# Altium schematic sheet Sheet1.SchDoc
size A3
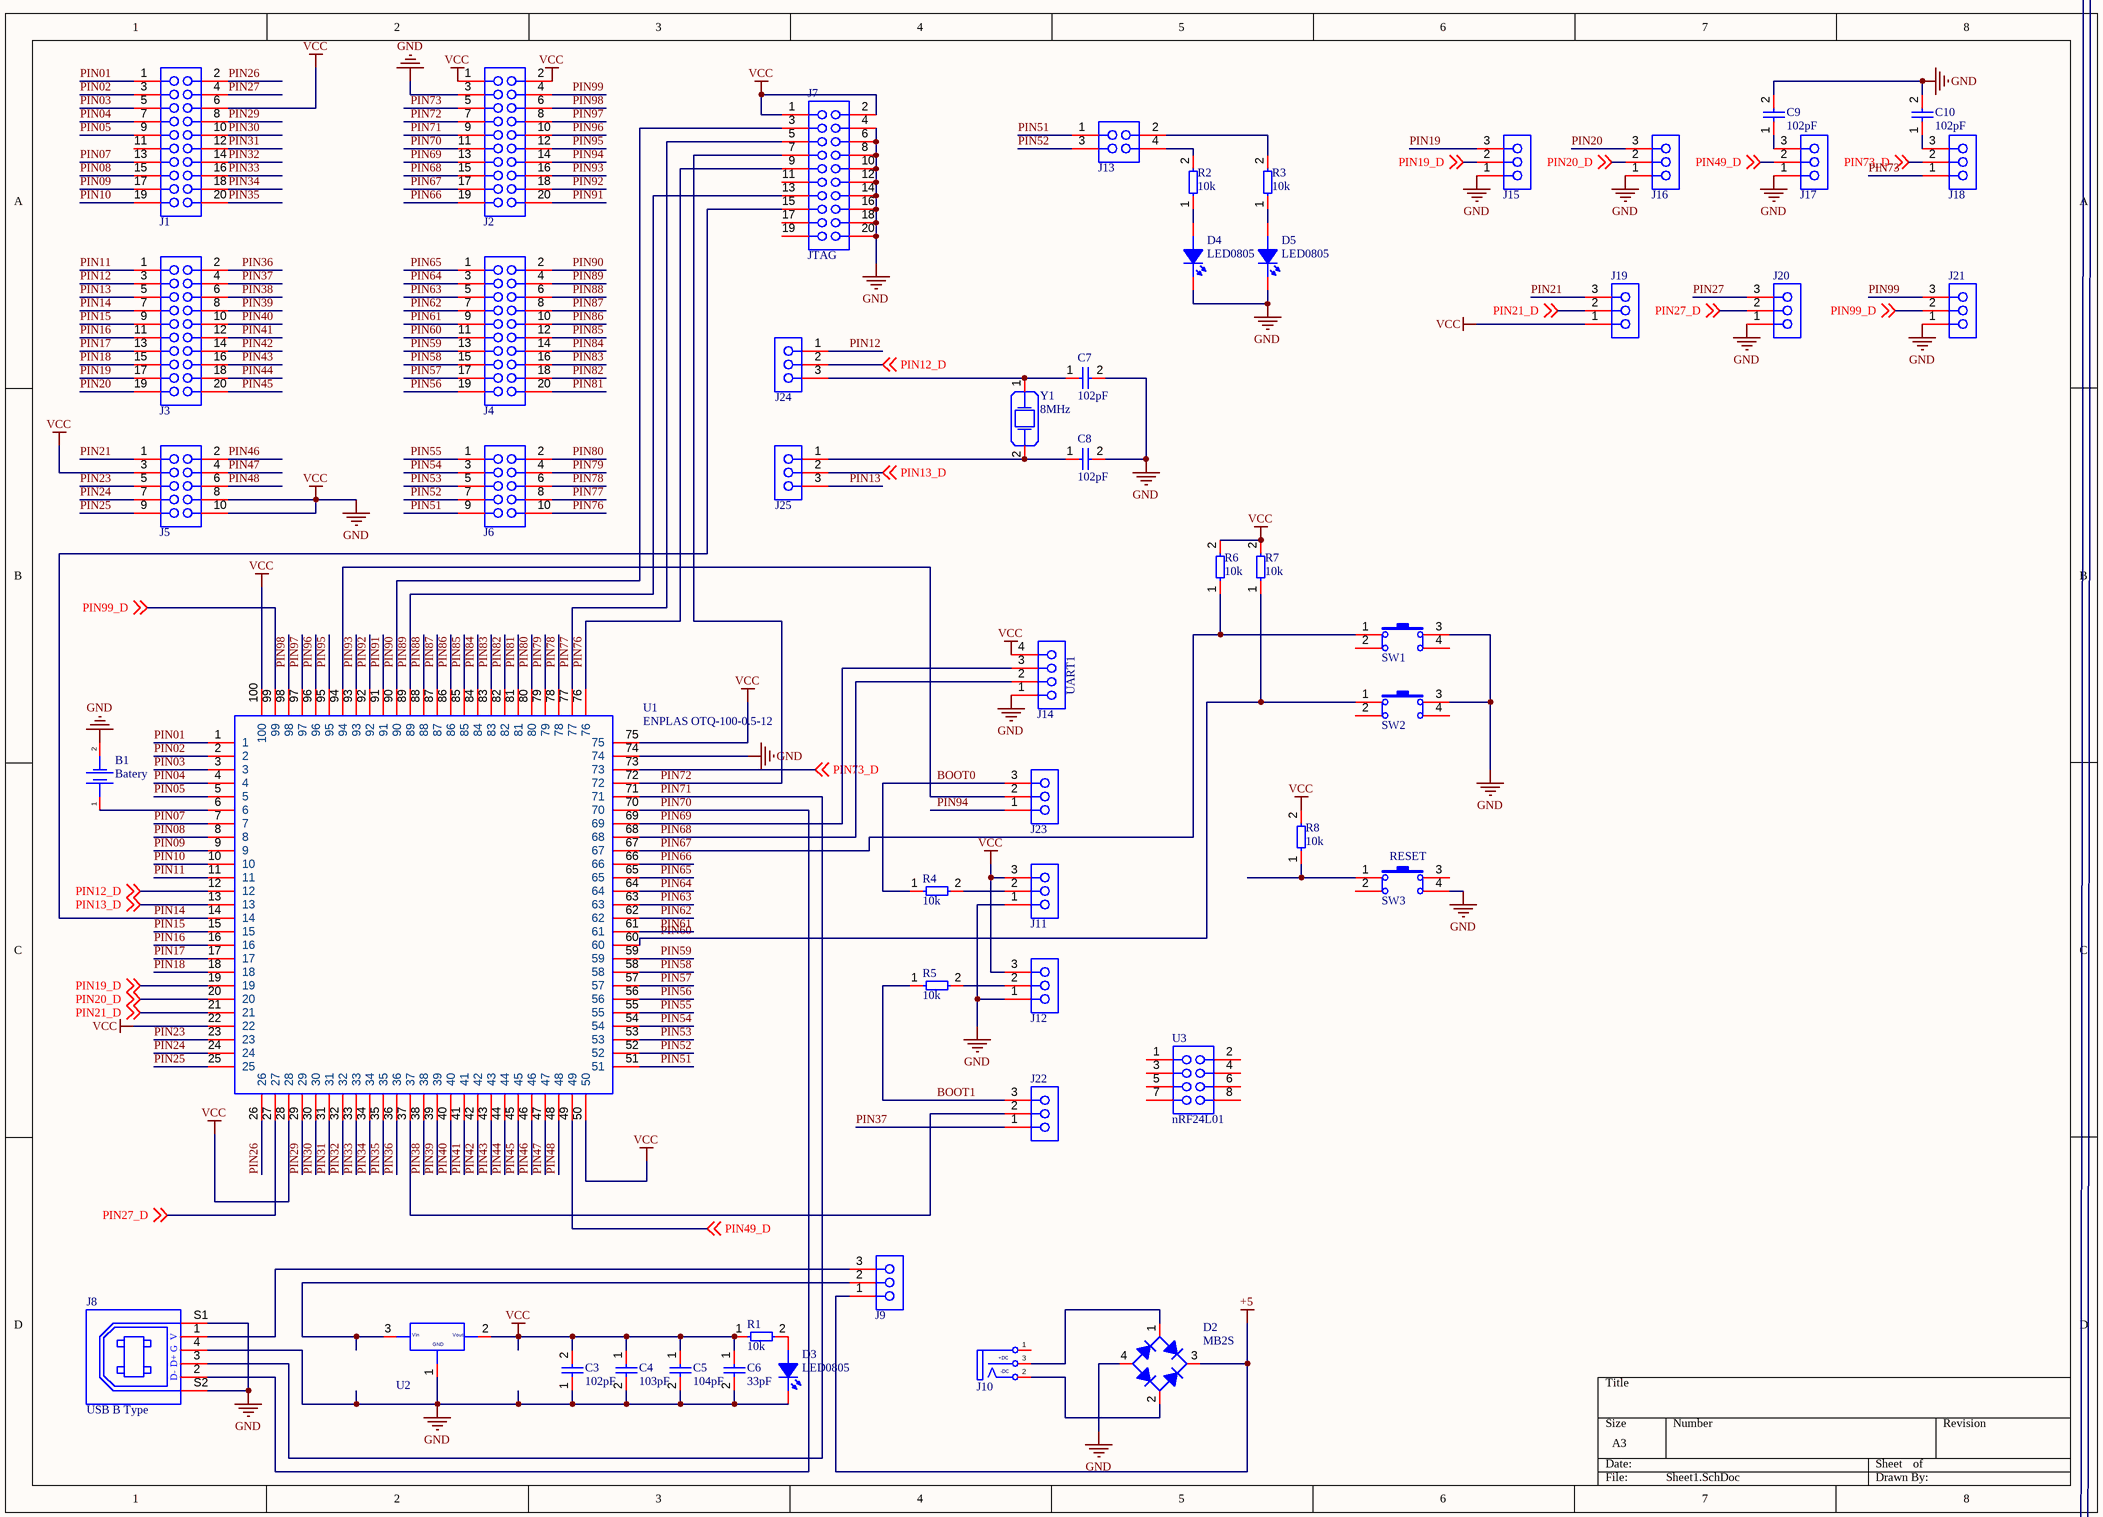
[diagram p0: Sheet1.SchDoc]

## Parts
B1  Batery  [CR1220]
C3  102pF  [C0805]
C4  103pF  [C0805]
C5  104pF  [C0805]
C6  33pF  [C0805]
C7  102pF  [C0805]
C8  102pF  [C0805]
C9  102pF  [C0805]
C10  102pF  [C0805]
D2  MB2S  [TO-269AA]
D3  LED0805  [L0805RED]
D4  LED0805  [L0805RED]
D5  LED0805  [L0805RED]
J1  Header 10x2 TH Pitch 2.54mm  [Header 10x2 TH Pitch 2.54mm]  (value not drawn)
J2  Header 10x2 TH Pitch 2.54mm  [Header 10x2 TH Pitch 2.54mm]  (value not drawn)
J3  Header 10x2 TH Pitch 2.54mm  [Header 10x2 TH Pitch 2.54mm]  (value not drawn)
J4  Header 10x2 TH Pitch 2.54mm  [Header 10x2 TH Pitch 2.54mm]  (value not drawn)
J5  Header 5x2 TH Pitch 2.54mm  [Header 5x2 TH Pitch 2.54mm]  (value not drawn)
J6  Header 5x2 TH Pitch 2.54mm  [Header 5x2 TH Pitch 2.54mm]  (value not drawn)
J7  JTAG  [IDC_CONNECTOR_20_2.54]
J8  USB B Type  [USB-B-TYPE]
J9  Header 3x1 TH Pitch 2.54mm  [Header 3x1 TH Pitch 2.54mm]  (value not drawn)
J10  Connector  [JACK-DC]  (value not drawn)
J11  Header 3x1 TH Pitch 2.54mm  [Header 3x1 TH Pitch 2.54mm]  (value not drawn)
J12  Header 3x1 TH Pitch 2.54mm  [Header 3x1 TH Pitch 2.54mm]  (value not drawn)
J13  Header 2x2 TH Pitch 2.54mm  [Header 2x2 TH Pitch 2.54mm]  (value not drawn)
J14  UART1  [Header 4x1 TH Pitch 2.54mm]
J15  Header 3x1 TH Pitch 2.54mm  [Header 3x1 TH Pitch 2.54mm]  (value not drawn)
J16  Header 3x1 TH Pitch 2.54mm  [Header 3x1 TH Pitch 2.54mm]  (value not drawn)
J17  Header 3x1 TH Pitch 2.54mm  [Header 3x1 TH Pitch 2.54mm]  (value not drawn)
J18  Header 3x1 TH Pitch 2.54mm  [Header 3x1 TH Pitch 2.54mm]  (value not drawn)
J19  Header 3x1 TH Pitch 2.54mm  [Header 3x1 TH Pitch 2.54mm]  (value not drawn)
J20  Header 3x1 TH Pitch 2.54mm  [Header 3x1 TH Pitch 2.54mm]  (value not drawn)
J21  Header 3x1 TH Pitch 2.54mm  [Header 3x1 TH Pitch 2.54mm]  (value not drawn)
J22  Header 3x1 TH Pitch 2.54mm  [Header 3x1 TH Pitch 2.54mm]  (value not drawn)
J23  Header 3x1 TH Pitch 2.54mm  [Header 3x1 TH Pitch 2.54mm]  (value not drawn)
J24  Header 3x1 TH Pitch 2.54mm  [Header 3x1 TH Pitch 2.54mm]  (value not drawn)
J25  Header 3x1 TH Pitch 2.54mm  [Header 3x1 TH Pitch 2.54mm]  (value not drawn)
R1  10k  [R0805]
R2  10k  [R0805]
R3  10k  [R0805]
R4  10k  [R0805]
R5  10k  [R0805]
R6  10k  [R0805]
R7  10k  [R0805]
R8  10k  [R0805]
SW1  Button Hole  [BUTTON_HOLE_5.0mm]  (value not drawn)
SW2  Button Hole  [BUTTON_HOLE_5.0mm]  (value not drawn)
SW3  RESET  [BUTTON_HOLE_5.0mm]
U1  ENPLAS OTQ-100-0.5-12  [ENPLAS OTQ-100-0.5-12-00 IC SOCKET]
U2  AMS1117  [SOT223-3]  (value not drawn)
U3  nRF24L01  [nRF24L01]
Y1  8MHz  [HC-49_THROUGH]

## Nets
+5: D2.3 J9.1
GND: B1.2 C3.1 C3.2 C4.1 C4.2 C5.1 C5.2 C6.1 C6.2 C7.2 C8.2 C9.2 C10.2 D2.4 D3.2(K) D4.2(K) D5.2(K) J1.6 J2.1 J2.2 J2.3 J5.3 J5.8 J5.10 J7.1 J7.2 J7.4 J7.6 J7.8 J7.10 J7.12 J7.14 J7.16 J7.18 J7.20 J8.4 J8.S1 J8.S2 J11.1 J11.3 J12.1 J12.3 J14.1 J14.4 J15.1 J16.1 J17.1 J19.1 J20.1 J21.1 R1.1 R6.2 R7.2 R8.2 SW1.3 SW2.3 SW3.4 U1.22 U1.28 U1.50 U1.74 U1.75 U1.100 U2.1 U2.2  [also labelled VCC]
BOOT0: J23.3 R4.1
BOOT1: J22.3 R5.1
PIN01: J1.1 U1.1
PIN02: J1.3 U1.2
PIN03: J1.5 U1.3
PIN04: J1.7 U1.4
PIN05: J1.9 U1.5
PIN07: J1.13 U1.7
PIN08: J1.15 U1.8
PIN09: J1.17 U1.9
PIN10: J1.19 U1.10
PIN11: J3.1 U1.11
PIN12: J3.3 J24.1
PIN12_D: J24.2 U1.12 ; off-sheet PIN12_D
PIN13: J3.5 J25.3
PIN13_D: J25.2 U1.13 ; off-sheet PIN13_D
PIN14: J3.7 J7.15 U1.14
PIN15: J3.9 U1.15
PIN16: J3.11 U1.16
PIN17: J3.13 U1.17
PIN18: J3.15 U1.18
PIN19: J3.17 J15.3
PIN19_D: J15.2 U1.19 ; off-sheet PIN19_D
PIN20: J3.19 J16.3
PIN20_D: J16.2 U1.20 ; off-sheet PIN20_D
PIN21: J5.1 J19.3
PIN21_D: J19.2 U1.21 ; off-sheet PIN21_D
PIN23: J5.5 U1.23
PIN24: J5.7 U1.24
PIN25: J5.9 U1.25
PIN26: J1.2 U1.26
PIN27: J1.4 J20.3
PIN27_D: J20.2 U1.27 ; off-sheet PIN27_D
PIN29: J1.8 U1.29
PIN30: J1.10 U1.30
PIN31: J1.12 U1.31
PIN32: J1.14 U1.32
PIN33: J1.16 U1.33
PIN34: J1.18 U1.34
PIN35: J1.20 U1.35
PIN36: J3.2 U1.36
PIN37: J3.4 J22.1
PIN38: J3.6 U1.38
PIN39: J3.8 U1.39
PIN40: J3.10 U1.40
PIN41: J3.12 U1.41
PIN42: J3.14 U1.42
PIN43: J3.16 U1.43
PIN44: J3.18 U1.44
PIN45: J3.20 U1.45
PIN46: J5.2 U1.46
PIN47: J5.4 U1.47
PIN48: J5.6 U1.48
PIN49_D: J17.2 U1.49 ; off-sheet PIN49_D
PIN51: J6.9 J13.1 U1.51
PIN52: J6.7 J13.3 U1.52
PIN53: J6.5 U1.53
PIN54: J6.3 U1.54
PIN55: J6.1 U1.55
PIN56: J4.19 U1.56
PIN57: J4.17 U1.57
PIN58: J4.15 U1.58
PIN59: J4.13 U1.59
PIN60: J4.11 R7.1 SW2.1 U1.60
PIN61: J4.9 U1.61
PIN62: J4.7 U1.62
PIN63: J4.5 U1.63
PIN64: J4.3 U1.64
PIN65: J4.1 U1.65
PIN66: J2.19 U1.66
PIN67: J2.17 R6.1 SW1.1 U1.67
PIN68: J2.15 J14.2 U1.68
PIN69: J2.13 J14.3 U1.69
PIN70: J2.11 J8.2 U1.70
PIN71: J2.9 J8.3 U1.71
PIN72: J2.7 J7.7 U1.72
PIN73: J2.5 J18.1
PIN73_D: J18.2 U1.73 ; off-sheet PIN73_D
PIN76: J6.10 J7.9 U1.76
PIN77: J6.8 J7.5 U1.77
PIN78: J6.6 U1.78
PIN79: J6.4 U1.79
PIN80: J6.2 U1.80
PIN81: J4.20 U1.81
PIN82: J4.18 U1.82
PIN83: J4.16 U1.83
PIN84: J4.14 U1.84
PIN85: J4.12 U1.85
PIN86: J4.10 U1.86
PIN87: J4.8 U1.87
PIN88: J4.6 U1.88
PIN89: J4.4 J7.13 U1.89
PIN90: J4.2 J7.3 U1.90
PIN91: J2.20 U1.91
PIN92: J2.18 U1.92
PIN93: J2.16 U1.93
PIN94: J2.14 J23.1
PIN95: J2.12 U1.95
PIN96: J2.10 U1.96
PIN97: J2.8 U1.97
PIN98: J2.6 U1.98
PIN99: J2.4 J21.3
PIN99_D: J21.2 U1.99 ; off-sheet PIN99_D
NetB1_1: B1.1 U1.6
NetC7_1: C7.1 J24.3 Y1.1
NetC8_1: C8.1 J25.1 Y1.2
NetC9_1: C9.1 J17.3
NetC10_1: C10.1 J18.3
NetD2_1: D2.1 J10.3(S)
NetD2_2: D2.2 J10.2(TN)
NetD3_1: D3.1(A) R1.2
NetD4_1: D4.1(A) R2.1
NetD5_1: D5.1(A) R3.1
NetJ8_1: J8.1 J9.3
NetJ9_2: J9.2 U2.3
NetJ11_2: J11.2 R4.2
NetJ12_2: J12.2 R5.2
NetJ13_2: J13.2 R3.2
NetJ13_4: J13.4 R2.2
NetJ22_2: J22.2 U1.37
NetJ23_2: J23.2 U1.94
NetR8_1: R8.1 SW3.1

Not connected (* = marked no-connect by the designer): J1 11; J7 11 17 19; J10 1(T); SW1 2 4; SW2 2 4; SW3 2 3; U3 1 2 3 4 5 6 7 8

## Notes on the sheet
- (in symbol AMS1117(SOT-223)) Vin; Vout; GND
- (in symbol JackDC) +DC; -DC
- (in symbol USB B Type) V; G; D+; D-

## Library data of the parts
C3-C10 = Capacitors(SMD)
D2 = Diode MB2S
J7 = IDC_2.54_10x2
J10 = JackDC
J14 = Header 4x1 TH Pitch 2.54mm
R1-R8 = Resistor SMD
SW3 = Button Hole
U1 = ENPLAS OTQ-100-0.5-12-00 IC SOCKET
U2 = AMS1117(SOT-223)
Y1 = Crystal